# Altium schematic sheet EEG_schematic.SchDoc (part 1 of 3)
size A2
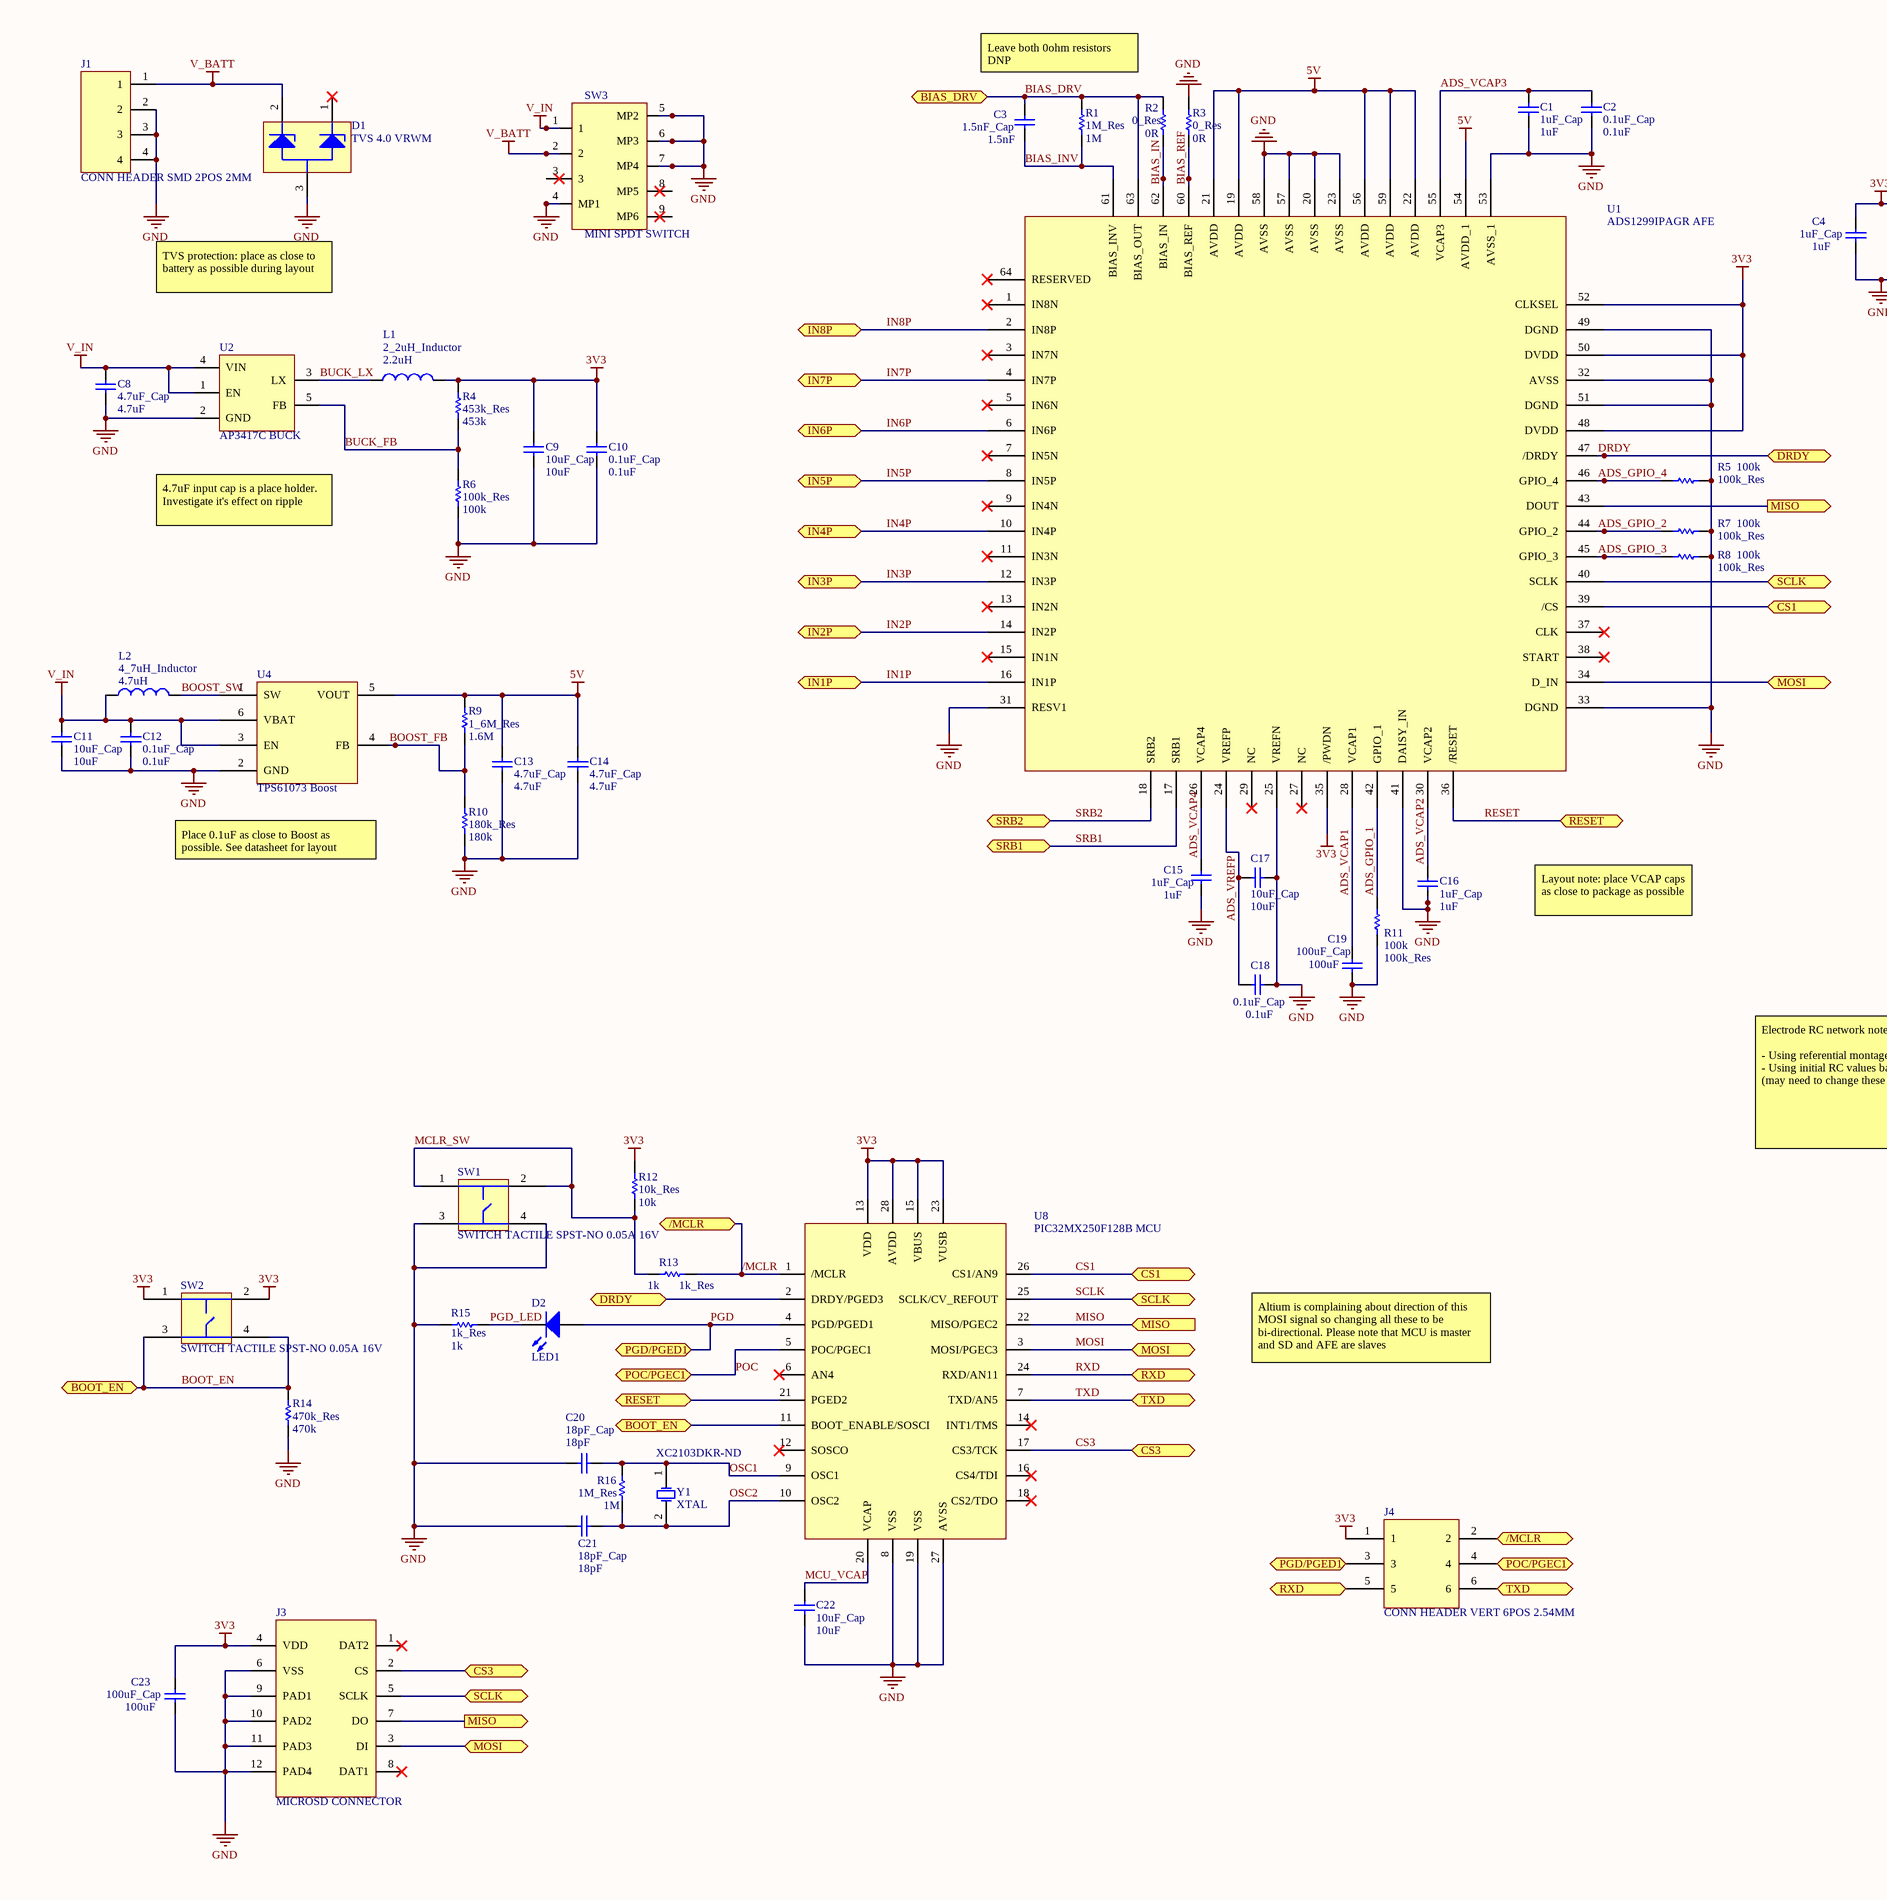
[diagram p0: EEG_schematic.SchDoc, left]
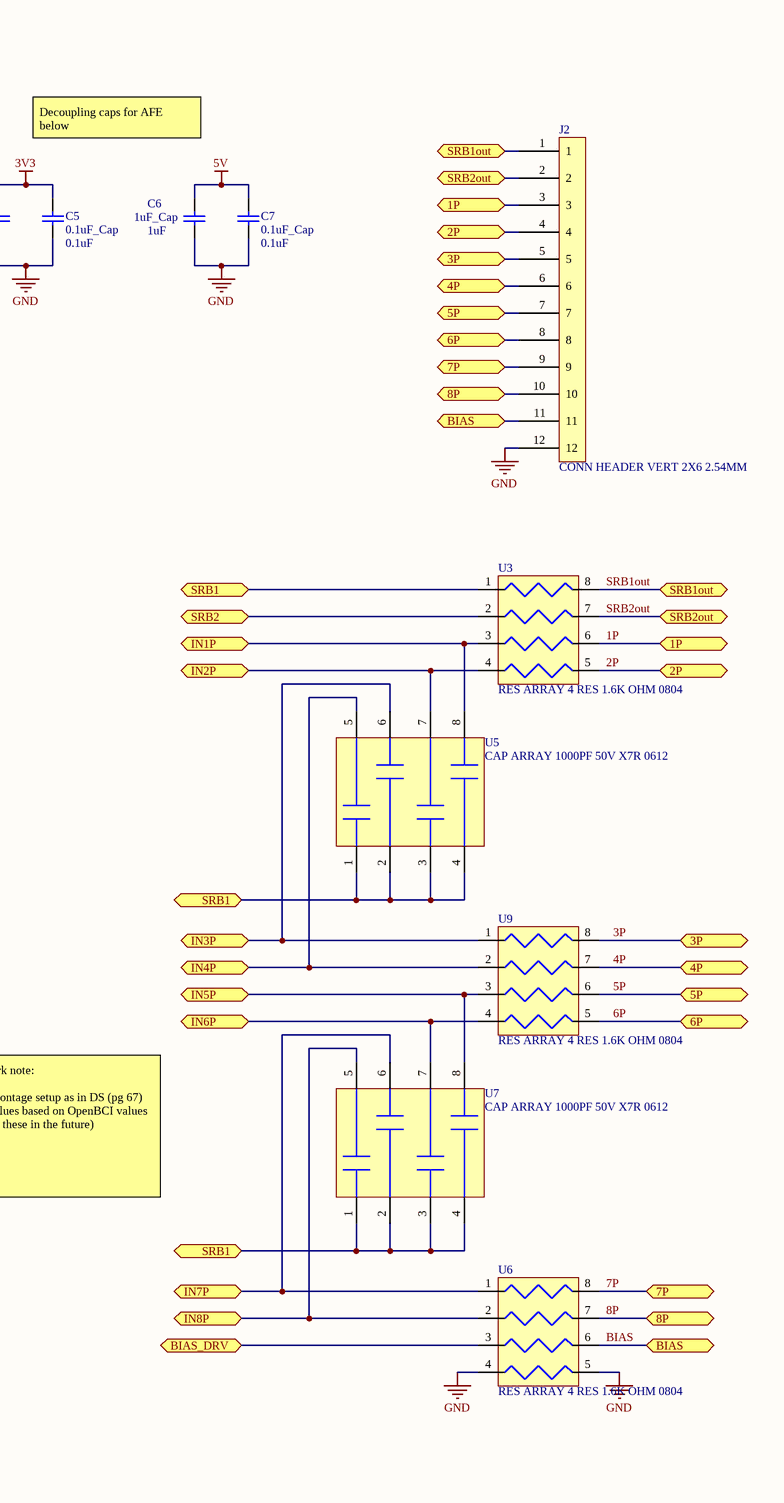
[diagram p1: EEG_schematic.SchDoc, right]

## Parts
C1  1uF_Cap  value 1uF  [0402resistor]
C2  0.1uF_Cap  value 0.1uF  [0402resistor]
C3  1.5nF_Cap  value 1.5nF  [0402resistor]
C4  1uF_Cap  value 1uF  [0402resistor]
C5  0.1uF_Cap  value 0.1uF  [0402resistor]
C6  1uF_Cap  value 1uF  [0402resistor]
C7  0.1uF_Cap  value 0.1uF  [0402resistor]
C8  4.7uF_Cap  value 4.7uF  [0402resistor]
C9  10uF_Cap  value 10uF  [0402resistor]
C10  0.1uF_Cap  value 0.1uF  [0402resistor]
C11  10uF_Cap  value 10uF  [0402resistor]
C12  0.1uF_Cap  value 0.1uF  [0402resistor]
C13  4.7uF_Cap  value 4.7uF  [0402resistor]
C14  4.7uF_Cap  value 4.7uF  [0402resistor]
C15  1uF_Cap  value 1uF  [0402resistor]
C16  1uF_Cap  value 1uF  [0402resistor]
C17  10uF_Cap  value 10uF  [0402resistor]
C18  0.1uF_Cap  value 0.1uF  [0402resistor]
C19  100uF_Cap  value 100uF  [1206resistor]
C20  18pF_Cap  value 18pF  [0402resistor]
C21  18pF_Cap  value 18pF  [0402resistor]
C22  10uF_Cap  value 10uF  [0402resistor]
C23  100uF_Cap  value 100uF  [1206resistor]
D1  TVS 4.0 VRWM  [SOT23-3_TVS]
D2  LED1  [LED]
J1  CONN HEADER SMD 2POS 2MM  [Battery_Conn]
J2  CONN HEADER VERT 2X6 2.54MM  [HDR1X12]
J3  MICROSD CONNECTOR  [SD_Conn]
J4  CONN HEADER VERT 6POS 2.54MM  [6pin_Header]
L1  2_2uH_Inductor  value 2.2uH  [0603INDUCTOR]
L2  4_7uH_Inductor  value 4.7uH  [0603INDUCTOR]
R1  1M_Res  value 1M  [0402resistor]
R2  0_Res  value 0R  [0402resistor]
R3  0_Res  value 0R  [0402resistor]
R4  453k_Res  value 453k  [0402resistor]
R5  100k_Res  value 100k  [0402resistor]
R6  100k_Res  value 100k  [0402resistor]
R7  100k_Res  value 100k  [0402resistor]
R8  100k_Res  value 100k  [0402resistor]
R9  1_6M_Res  value 1.6M  [0402resistor]
R10  180k_Res  value 180k  [0402resistor]
R11  100k_Res  value 100k  [0402resistor]
R12  10k_Res  value 10k  [0402resistor]
R13  1k_Res  value 1k  [0402resistor]
R14  470k_Res  value 470k  [0402resistor]
R15  1k_Res  value 1k  [0402resistor]
R16  1M_Res  value 1M  [0402resistor]
SW1  SWITCH TACTILE SPST-NO 0.05A 16V  [BasicTwoPinSwitch]
SW2  SWITCH TACTILE SPST-NO 0.05A 16V  [BasicTwoPinSwitch]
SW3  MINI SPDT SWITCH  [SW_SPDT]
U1  ADS1299IPAGR AFE  [64-TQFP]
U2  AP3417C BUCK  [SOT23_Buck]
U3  RES ARRAY 4 RES 1.6K OHM 0804  [Rarray]
U4  TPS61073 Boost  [SOT23-6]
U5  CAP ARRAY 1000PF 50V X7R 0612  [Cap_array]
U6  RES ARRAY 4 RES 1.6K OHM 0804  [Rarray]
U7  CAP ARRAY 1000PF 50V X7R 0612  [Cap_array]
U8  PIC32MX250F128B MCU  [SSOP28]
U9  RES ARRAY 4 RES 1.6K OHM 0804  [Rarray]
Y1  XTAL  Supplier Part Number 1: XC2103DKR-ND  [3x5mm_XTAL]

## Ports
1P (bidir), 2P (bidir), 3P (bidir), 4P (bidir), 5P (bidir), 6P (bidir), 7P (bidir), 8P (bidir), /MCLR (bidir), BIAS (bidir), BIAS_DRV (bidir), BOOT_EN (bidir), CS1 (bidir), CS3 (bidir), DRDY (bidir), IN1P (bidir), IN2P (bidir), IN3P (bidir), IN4P (bidir), IN5P (bidir), IN6P (bidir), IN7P (bidir), IN8P (bidir), MISO (in), MISO (out), MOSI (bidir), PGD/PGED1 (bidir), POC/PGEC1 (bidir), RESET (bidir), RXD (bidir), SCLK (bidir), SRB1 (bidir), SRB1out (bidir), SRB2 (bidir), SRB2out (bidir), TXD (bidir)

## Nets
3V3: C4.2 C5.2 C9.2 C10.2 C23.2 J3.4(VDD) J4.1 L1.2 R4.2 R12.2 SW2.1 SW2.2 U1.35(/PWDN) U1.48(DVDD) U1.50(DVDD) U1.52(CLKSEL) U8.13(VDD) U8.15(VBUS) U8.23(VUSB) U8.28(AVDD)
5V: C6.2 C7.2 C13.2 C14.2 R9.2 U1.19(AVDD) U1.21(AVDD) U1.22(AVDD) U1.54(AVDD_1) U1.56(AVDD) U1.59(AVDD) U4.5(VOUT)
GND: C1.1 C2.1 C4.1 C5.1 C6.1 C7.1 C8.1 C9.1 C10.1 C11.1 C12.1 C13.1 C14.1 C15.1 C16.1 C17.2 C18.2 C19.1 C20.1 C21.1 C22.1 C23.1 D1.3 J1.2 J1.3 J1.4 J2.12 J3.6(VSS) J3.9(PAD1) J3.10(PAD2) J3.11(PAD3) J3.12(PAD4) R3.2 R5.2 R6.1 R7.2 R8.2 R10.1 R11.1 R14.1 R15.1 SW1.3 SW1.4 SW3.4(MP1) SW3.5(MP2) SW3.6(MP3) SW3.7(MP4) U1.20(AVSS) U1.23(AVSS) U1.25(VREFN) U1.31(RESV1) U1.32(AVSS) U1.33(DGND) U1.41(DAISY_IN) U1.49(DGND) U1.51(DGND) U1.53(AVSS_1) U1.57(AVSS) U1.58(AVSS) U2.2(GND) U4.2(GND) U6.4 U6.5 U8.8(VSS) U8.19(VSS) U8.27(AVSS)
V_BATT: D1.2 J1.1 SW3.2
V_IN: C8.2 C11.2 C12.2 L2.1 SW3.1 U2.1(EN) U2.4(VIN) U4.3(EN) U4.6(VBAT)
1P: J2.3 U3.6 ; port 1P
2P: J2.4 U3.5 ; port 2P
3P: J2.5 U9.8 ; port 3P
4P: J2.6 U9.7 ; port 4P
5P: J2.7 U9.6 ; port 5P
6P: J2.8 U9.5 ; port 6P
7P: J2.9 U6.8 ; port 7P
8P: J2.10 U6.7 ; port 8P
/MCLR: J4.2 R13.1 U8.1(/MCLR) ; port /MCLR
ADS_GPIO_1: R11.2 U1.42(GPIO_1)
ADS_GPIO_2: R7.1 U1.44(GPIO_2)
ADS_GPIO_3: R8.1 U1.45(GPIO_3)
ADS_GPIO_4: R5.1 U1.46(GPIO_4)
ADS_VCAP1: C19.2 U1.28(VCAP1)
ADS_VCAP2: C16.2 U1.30(VCAP2)
ADS_VCAP3: C1.2 C2.2 U1.55(VCAP3)
ADS_VCAP4: C15.2 U1.26(VCAP4)
ADS_VREFP: C17.1 C18.1 U1.24(VREFP)
BIAS: J2.11 U6.6 ; port BIAS
BIAS_DRV: C3.2 R1.2 R2.2 U1.63(BIAS_OUT) U6.3 ; port BIAS_DRV
BIAS_IN: R2.1 U1.62(BIAS_IN)
BIAS_INV: C3.1 R1.1 U1.61(BIAS_INV)
BIAS_REF: R3.1 U1.60(BIAS_REF)
BOOST_FB: R9.1 R10.2 U4.4(FB)
BOOST_SW: L2.2 U4.1(SW)
BOOT_EN: R14.2 SW2.3 SW2.4 U8.11(BOOT_ENABLE/SOSCI) ; port BOOT_EN
BUCK_FB: R4.1 R6.2 U2.5(FB)
BUCK_LX: L1.1 U2.3(LX)
CS1: U1.39(/CS) U8.26(CS1/AN9) ; port CS1
CS3: J3.2(CS) U8.17(CS3/TCK) ; port CS3
DRDY: U1.47(/DRDY) U8.2(DRDY/PGED3) ; port DRDY
IN1P: U1.16(IN1P) U3.3 U5.8 ; port IN1P
IN2P: U1.14(IN2P) U3.4 U5.7 ; port IN2P
IN3P: U1.12(IN3P) U5.6 U9.1 ; port IN3P
IN4P: U1.10(IN4P) U5.5 U9.2 ; port IN4P
IN5P: U1.8(IN5P) U7.8 U9.3 ; port IN5P
IN6P: U1.6(IN6P) U7.7 U9.4 ; port IN6P
IN7P: U1.4(IN7P) U6.1 U7.6 ; port IN7P
IN8P: U1.2(IN8P) U6.2 U7.5 ; port IN8P
MCLR_SW: R12.1 R13.2 SW1.1 SW1.2
MCU_VCAP: C22.2 U8.20(VCAP)
MISO: J3.7(DO) U1.43(DOUT) U8.22(MISO/PGEC2) ; port MISO
MOSI: J3.3(DI) U1.34(D_IN) U8.3(MOSI/PGEC3) ; port MOSI
OSC1: C20.2 R16.2 U8.9(OSC1) Y1.1(OSC1)
OSC2: C21.2 R16.1 U8.10(OSC2) Y1.2(OSC2)
PGD: D2.1(A) J4.3 U8.4(PGD/PGED1) ; port PGD/PGED1
PGD_LED: D2.2(K) R15.2
POC: J4.4 U8.5(POC/PGEC1) ; port POC/PGEC1
RESET: U1.36(/RESET) U8.21(PGED2) ; port RESET
RXD: J4.5 U8.24(RXD/AN11) ; port RXD
SCLK: J3.5(SCLK) U1.40(SCLK) U8.25(SCLK/CV_REFOUT) ; port SCLK
SRB1: U1.17(SRB1) U3.1 U5.1 U5.2 U5.3 U5.4 U7.1 U7.2 U7.3 U7.4 ; port SRB1
SRB1out: J2.1 U3.8 ; port SRB1out
SRB2: U1.18(SRB2) U3.2 ; port SRB2
SRB2out: J2.2 U3.7 ; port SRB2out
TXD: J4.6 U8.7(TXD/AN5) ; port TXD

Not connected (* = marked no-connect by the designer): D1 1*; J3 1(DAT2)* 8(DAT1)*; SW3 3 8(MP5) 9(MP6); U1 1(IN8N)* 3(IN7N)* 5(IN6N)* 7(IN5N)* 9(IN4N)* 11(IN3N)* 13(IN2N)* 15(IN1N)* 27(NC)* 29(NC)* 37(CLK)* 38(START)* 64(RESERVED)*; U8 6(AN4)* 12(SOSCO)* 14(INT1/TMS)* 16(CS4/TDI)* 18(CS2/TDO)*

## Notes on the sheet
- Leave both 0ohm resistors DNP
- Decoupling caps for AFE below
- TVS protection: place as close to battery as possible during layout
- 4.7uF input cap is a place holder. Investigate it's effect on ripple
- Place 0.1uF as close to Boost as possible. See datasheet for layout guidelines
- Layout note: place VCAP caps as close to package as possible
- Electrode RC network note:
  - Using referential montage setup as in DS (pg 67)
  - Using initial RC values based on OpenBCI values (may need to change these in the future)
- Altium is complaining about direction of this MOSI signal so changing all these to be bi-directional. Please note that MCU is master and SD and AFE are slaves